# Altium project ConnectorBreakout.PrjPCB
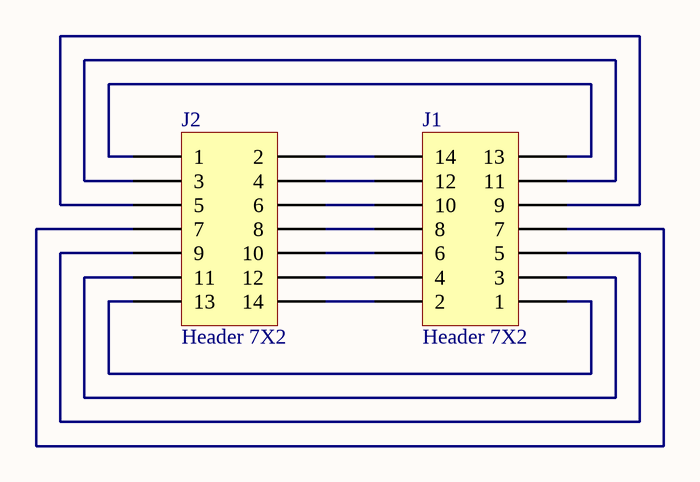
[diagram p0: ConnectorBreakout.SchDoc]
1 sheet, 2 parts. Net scope: global (net labels, ports and power ports of the same name join across sheets).
Board file: ConnectorBreakout.PcbDoc

## Sheet ConnectorBreakout.SchDoc
size A

### Parts
J1  Header 7X2  [HDR2X7H]
J2  Header 7X2  [CLP-107-02-L-DH-TR]

### Nets
NetJ1_1: J1.1 J2.13
NetJ1_2: J1.2 J2.14
NetJ1_3: J1.3 J2.11
NetJ1_4: J1.4 J2.12
NetJ1_5: J1.5 J2.9
NetJ1_6: J1.6 J2.10
NetJ1_7: J1.7 J2.7
NetJ1_8: J1.8 J2.8
NetJ1_9: J1.9 J2.5
NetJ1_10: J1.10 J2.6
NetJ1_11: J1.11 J2.3
NetJ1_12: J1.12 J2.4
NetJ1_13: J1.13 J2.1
NetJ1_14: J1.14 J2.2

### Library data of the parts
J1 J2 = Header 7X2: Header, 7-Pin, Dual row; System: Connector; LatestRevisionDate: 17-Jul-2002; LatestRevisionNote: Re-released for DXP Platform.; Publisher: Altium Limited